# Altium project musedash-peaches.PrjPCB
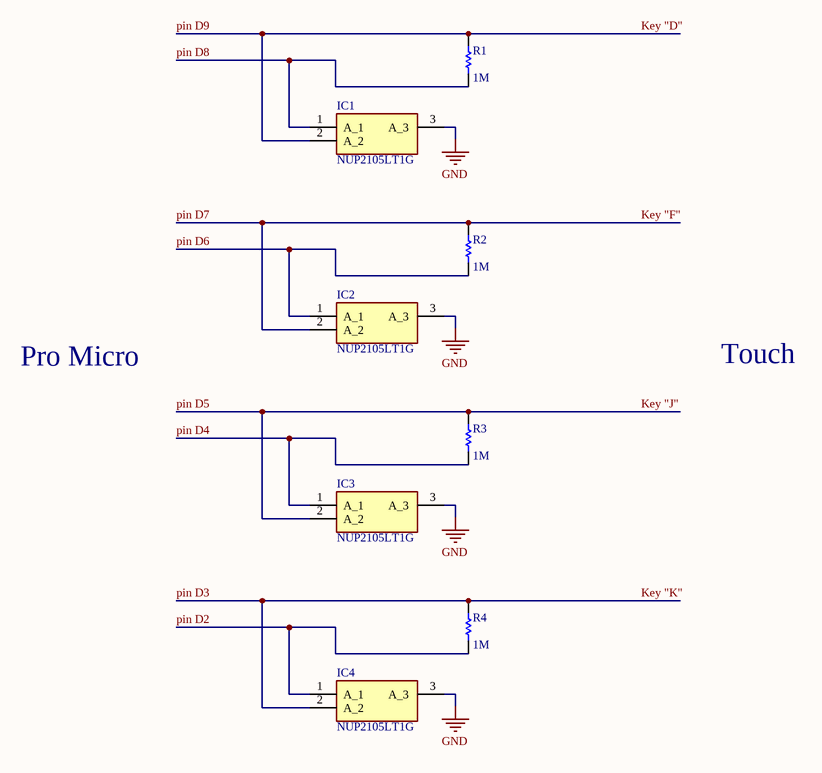
[diagram p0: v2.SchDoc]
1 sheet, 8 parts. Net scope: global (net labels, ports and power ports of the same name join across sheets).
Board file: v2.PcbDoc

## Sheet v2.SchDoc: MuseDash-Peaches Board
size A4; DrawnBy: ciisaichan; Revision: v1.2

### Parts
IC1  NUP2105LT1G  [SOT96P237X111-3N]
IC2  NUP2105LT1G  [SOT96P237X111-3N]
IC3  NUP2105LT1G  [SOT96P237X111-3N]
IC4  NUP2105LT1G  [SOT96P237X111-3N]
R1  value 1M  [AXIAL-0.3]  (hidden comment: Res1)
R2  value 1M  [AXIAL-0.3]  (hidden comment: Res1)
R3  value 1M  [AXIAL-0.3]  (hidden comment: Res1)
R4  value 1M  [AXIAL-0.3]  (hidden comment: Res1)

### Nets
GND: IC1.3(A_3) IC2.3(A_3) IC3.3(A_3) IC4.3(A_3)
Key "D": IC1.2(A_2) R1.2  [also labelled pin D9]
Key "F": IC2.2(A_2) R2.2  [also labelled pin D7]
Key "J": IC3.2(A_2) R3.2  [also labelled pin D5]
Key "K": IC4.2(A_2) R4.2  [also labelled pin D3]
pin D2: IC4.1(A_1) R4.1
pin D4: IC3.1(A_1) R3.1
pin D6: IC2.1(A_1) R2.1
pin D8: IC1.1(A_1) R1.1

### Notes on the sheet
- Pro Micro
- Touch

### Library data of the parts
IC1-IC4 = NUP2105LT1G: Integrated Circuit; Manufacturer_Name: ON Semiconductor; Datasheet Link: https://www.onsemi.com/pub/Collateral/NUP2105L-D.PDF; Height: 1.11mm; Manufacturer_Part_Number: NUP2105LT1G; Arrow Part Number: NUP2105LT1G; Arrow Price/Stock: https://www.arrow.com/en/products/nup2105lt1g/on-semiconductor; Mouser Part Number: 863-NUP2105LT1G; Mouser Price/Stock: https://www.mouser.co.uk/ProductDetail/ON-Semiconductor/NUP2105LT1G?qs=ZXBb0xZ9WeDHmiHN%252BYKtYA%3D%3D
R1-R4 = Res1: Resistor; Published: 8-Jun-2000; LatestRevisionDate: 17-Jul-2002; LatestRevisionNote: Re-released for DXP Platform.; PackageReference: AXIAL-0.3; Publisher: Altium Limited; PackageDescription: Axial Device, Thru-Hole; 2 Leads; 0.3 in Pin Spacing